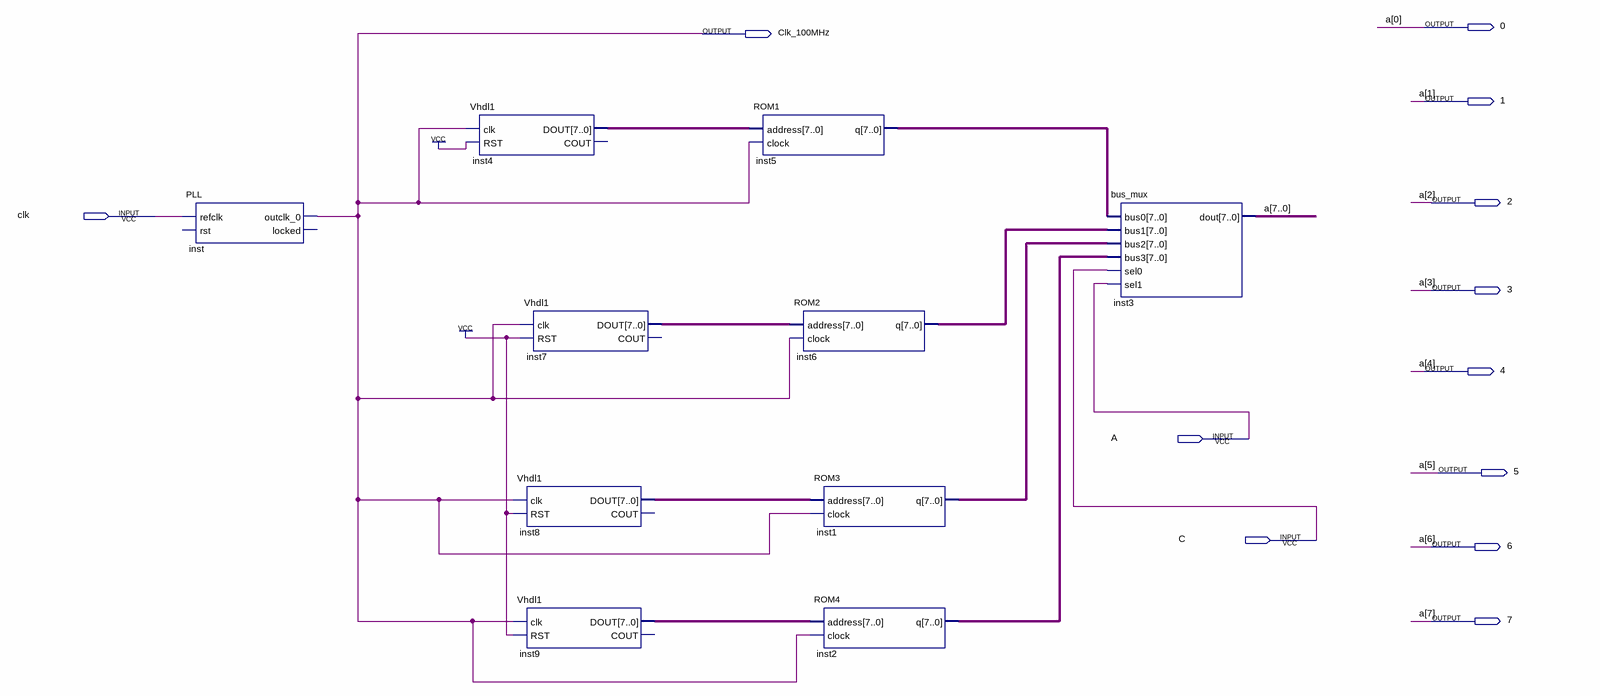
[diagram p0: schematic sheet]
// Quartus schematic DB.bdf as structural Verilog: 10 symbols, 12 pins
module DB (
  input  clk,
  input  A,
  input  C,
  output \0 ,
  output Clk_100MHz,
  output \1 ,
  output \2 ,
  output \3 ,
  output \4 ,
  output \5 ,
  output \6 ,
  output \7 
);

  wire [7:0] inst1_q, inst2_q, inst4_dout, inst5_q, inst6_q, inst7_dout, inst8_dout, inst9_dout;

  PLL inst (.refclk(clk), .outclk_0(Clk_100MHz));  // open: rst, locked
  Vhdl1 inst4 (.clk(Clk_100MHz), .RST(1'b1), .DOUT(inst4_dout));  // open: COUT
  Vhdl1 inst7 (.clk(Clk_100MHz), .RST(1'b1), .DOUT(inst7_dout));  // open: COUT
  Vhdl1 inst8 (.clk(Clk_100MHz), .RST(1'b1), .DOUT(inst8_dout));  // open: COUT
  Vhdl1 inst9 (.clk(Clk_100MHz), .RST(1'b1), .DOUT(inst9_dout));  // open: COUT
  ROM1 inst5 (.address(inst4_dout), .clock(Clk_100MHz), .q(inst5_q));
  ROM2 inst6 (.address(inst7_dout), .clock(Clk_100MHz), .q(inst6_q));
  ROM3 inst1 (.address(inst8_dout), .clock(Clk_100MHz), .q(inst1_q));
  ROM4 inst2 (.address(inst9_dout), .clock(Clk_100MHz), .q(inst2_q));
  bus_mux inst3 (
    .bus0(inst5_q), .bus1(inst6_q), .bus2(inst1_q), .bus3(inst2_q), .sel0(C), .sel1(A),
    .dout({\7 , \6 , \5 , \4 , \3 , \2 , \1 , \0 }));

  // Other names for the same wires on the sheet: A[7:0] = {\7 , \6 , \5 , \4 , \3 , \2 , \1 , \0 }
endmodule
